# Altium schematic sheet PowerBoard.SchDoc
size A4; SheetNumber: 1; SheetTotal: 1
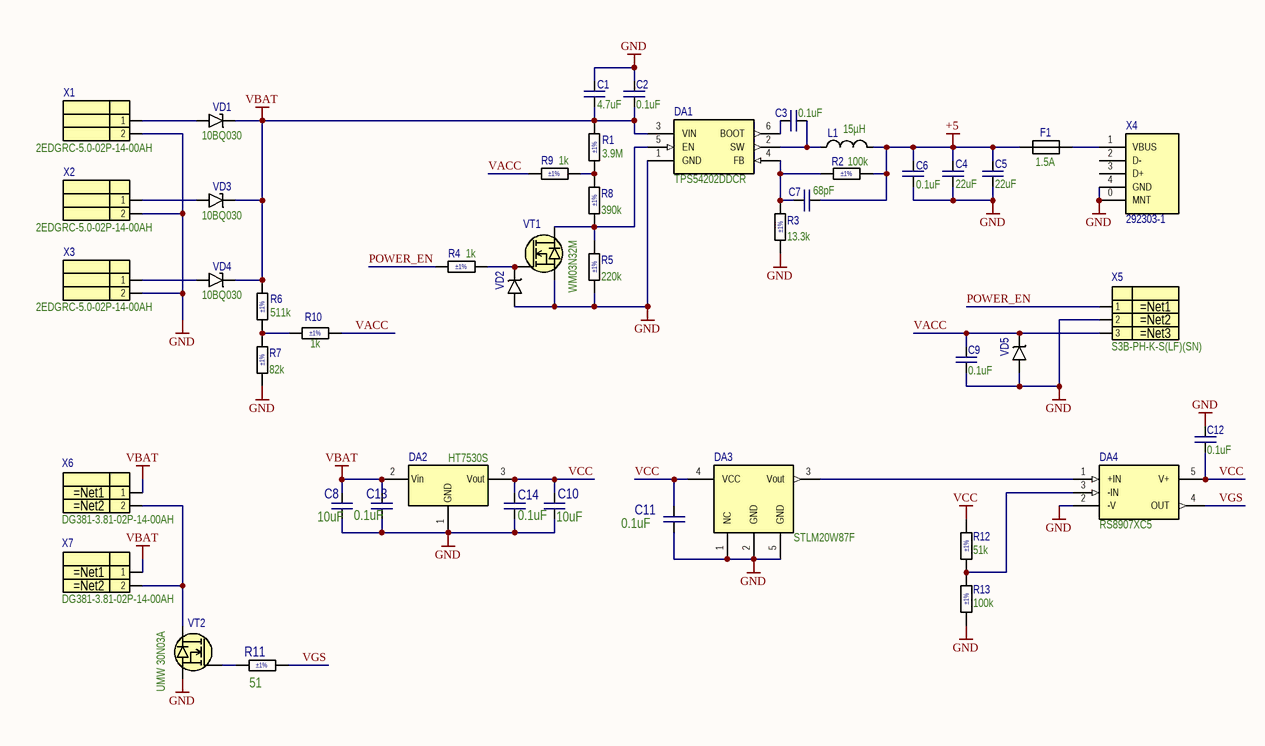
[diagram p0: PowerBoard.SchDoc]

## Parts
C1  4.7uF  [C0805 (2012 Metric) N]
C2  0.1uF  [C0603 (1608 Metric) N]
C3  0.1uF  [C0603 (1608 Metric) N]
C4  22uF  [C0805 (2012 Metric) N]
C5  22uF  [C0805 (2012 Metric) N]
C6  0.1uF  [C0603 (1608 Metric) N]
C7  68pF  [C0603 (1608 Metric) N]
C8  10uF  [C0603 (1608 Metric) N]
C9  0.1uF  [C0603 (1608 Metric) N]
C10  10uF  [C0603 (1608 Metric) N]
C11  0.1uF  [C0603 (1608 Metric) N]
C12  0.1uF  [C0603 (1608 Metric) N]
C13  0.1uF  [C0603 (1608 Metric) N]
C14  0.1uF  [C0603 (1608 Metric) N]
DA1  TPS54202DDCR  [SOT95P280X110-6N]
DA2  HT7530S  [SOT23-3]
DA3  STLM20W87F  [STLM20DD9F - duplicate]
DA4  RS8907XC5  [SOT23-5]
F1  1.5A  [F0603 (1608 Metric) N]
L1  15µH  [CDRH5D28]
R1  3.9M  Tolerance: ±1%  [R0603 (1608 Metric) N]
R2  100k  Tolerance: ±1%  [R0603 (1608 Metric) N]
R3  13.3k  Tolerance: ±1%  [R0603 (1608 Metric) N]
R4  1k  Tolerance: ±1%  [R0603 (1608 Metric) N]
R5  220k  Tolerance: ±1%  [R0603 (1608 Metric) N]
R6  511k  Tolerance: ±1%  [R0603 (1608 Metric) N]
R7  82k  Tolerance: ±1%  [R0603 (1608 Metric) N]
R8  390k  Tolerance: ±1%  [R0603 (1608 Metric) N]
R9  1k  Tolerance: ±1%  [R0603 (1608 Metric) N]
R10  1k  Tolerance: ±1%  [R0603 (1608 Metric) N]
R11  51  Tolerance: ±1%  [R0603 (1608 Metric) N]
R12  51k  Tolerance: ±1%  [R0603 (1608 Metric) N]
R13  100k  Tolerance: ±1%  [R0603 (1608 Metric) N]
VD1  10BQ030  [DO-214AA ( SMB )]
VD2  PESD12VS1UB  [SOD-523]  (value not drawn)
VD3  10BQ030  [DO-214AA ( SMB )]
VD4  10BQ030  [DO-214AA ( SMB )]
VD5  PESD12VS1UB  [SOD-523]  (value not drawn)
VT1  WM03N32M  [SOT95P245X110-3N]
VT2  UMW 30N03A  [TO-252]
X1  2EDGRC-5.0-02P-14-00AH  [2EDGRC-5.0-02P-14]
X2  2EDGRC-5.0-02P-14-00AH  [2EDGRC-5.0-02P-14]
X3  2EDGRC-5.0-02P-14-00AH  [2EDGRC-5.0-02P-14]
X4  292303-1  [TE-292303-1]
X5  S3B-PH-K-S(LF)(SN)  [S3B-PH-K-S(LF)(SN)]
X6  DG381-3.81-02P-14-00AH  [DG381-3.81-02P-14-00AH]
X7  DG381-3.81-02P-14-00AH  [DG381-3.81-02P-14-00AH]

## Nets
+5: C4.1 C5.1 C6.2 C7.2 F1.1 L1.2 R2.2
GND: C1.1 C2.2 C4.2 C5.2 C6.1 C8.2 C9.1 C10.2 C11.2 C12.2 C13.2 C14.2 DA1.1(GND) DA2.1(GND) DA3.1(NC) DA3.2(GND) DA3.5(GND) DA4.2(-V) R3.1 R5.1 R7.1 R13.1 VD2.A VD5.A VT1.S VT2.S X1.2 X2.2 X3.2 X4.0(MNT) X4.4(GND) X5.2
VBAT: C1.2 C2.1 C8.1 C13.1 DA1.3(VIN) DA2.2(Vin) R1.2 R6.2 VD1.C VD3.C VD4.C X6.1 X7.1
VCC: C10.1 C11.1 C12.1 C14.1 DA2.3(Vout) DA3.4(VCC) DA4.5(V+) R12.2
POWER_EN: R4.1 X5.1
VACC: C9.2 R9.1 R10.2 VD5.C X5.3
VGS: DA4.4(OUT) R11.2
NetC3_1: C3.1 DA1.6(BOOT)
NetC3_2: C3.2 DA1.2(SW) L1.1
NetC7_1: C7.1 DA1.4(FB) R2.1 R3.2
NetDA1_5: DA1.5(EN) R5.2 R8.1 VT1.D
NetDA3_3: DA3.3(Vout) DA4.1(+IN)
NetDA4_3: DA4.3(-IN) R12.1 R13.2
NetF1_2: F1.2 X4.1(VBUS)
NetR1_1: R1.1 R8.2 R9.2
NetR4_2: R4.2 VD2.C VT1.G
NetR6_1: R6.1 R7.2 R10.1
NetR11_1: R11.1 VT2.G
NetVD1_A: VD1.A X1.1
NetVD3_A: VD3.A X2.1
NetVD4_A: VD4.A X3.1
NetVT2_D: VT2.D X6.2 X7.2

Not connected (* = marked no-connect by the designer): X4 2(D-) 3(D+)

## Library data of the parts
C1 = CL21A475KBQNNNE: CAP CER 4.7UF 50V X5R 0805; Manufacturer: Samsung Electro-Mechanics; Points: 2; Factory Stock: 0; Unit Price (USD): 0.12360; Minimum Quantity: 2000; Tolerance: ±10%; Part Number: CL21A475KBQNNNE; ComponentLink1URL: http://www.samsungsem.com/kr/support/product-search/mlcc/CL21A475KBQNNNE.jsp; ComponentLink1Description: Datasheet; Supplier 1: Digikey; Supplier Part Number 1: 1276-1248-1-ND; Image: //media.digikey.com/Renders/Samsung%20Electro-Mechanics%20America/0805-(1.40)-CL-Series.jpg; Quantity Available: 20000; @ qty: 0; Packaging: Tape & Reel (TR); Series: CL; Part Status: Active; Value: 4.7uF; Voltage - Rated: 50V; Temperature Coefficient: X5R; Operating Temperature: -55°C ~ 85°C; Features: -; Ratings: -; Applications: General Purpose; Failure Rate: -; Mounting Type: Surface Mount, MLCC; Package / Case: 0805 (2012 Metric); Size / Dimension: 0.079" L x 0.049" W (2.00mm x 1.25mm); Height - Seated (Max): -; Thickness (Max): 0.055" (1.40mm); Lead Spacing: -; Lead Style: -; Part Type: Capacitor
C2 C3 C6 C9 C12 = CL10B104KB8NNNC: CAP CER 0.1UF 50V X7R 0603; Manufacturer: Samsung Electro-Mechanics; Points: 2; Factory Stock: 0; Unit Price (USD): 0.00627; Minimum Quantity: 4000; Tolerance: ±10%; Part Number: CL10B104KB8NNNC; ComponentLink1URL: http://www.samsungsem.com/kr/support/product-search/mlcc/CL10B104KB8NNNC.jsp; ComponentLink1Description: Datasheet; Supplier 1: Digikey; Supplier Part Number 1: 1276-1000-1-ND; Image: //media.digikey.com/Renders/Samsung%20Electro-Mechanics%20America/CL%20Series%200603(1608%20Metric)%2010.jpg; Quantity Available: 0; @ qty: 0; Packaging: Tape & Reel (TR); Series: CL; Part Status: Active; Value: 0.1uF; Voltage - Rated: 50V; Temperature Coefficient: X7R; Operating Temperature: -55°C ~ 125°C; Features: -; Ratings: -; Applications: General Purpose; Failure Rate: -; Mounting Type: Surface Mount, MLCC; Package / Case: 0603 (1608 Metric); Size / Dimension: 0.063" L x 0.032" W (1.60mm x 0.80mm); Height - Seated (Max): -; Thickness (Max): 0.035" (0.90mm); Lead Spacing: -; Lead Style: -; Part Type: Capacitor
C4 C5 = CC0805MKX5R6BB226: CAP CER 22UF 10V X5R 0805; Manufacturer: Yageo; Points: 2; Factory Stock: 0; Unit Price (USD): Active; Tolerance: ±20%; Part Number: CC0805MKX5R6BB226; ComponentLink1URL: http://www.yageo.com/documents/recent/UPY-GPHC_X5R_4V-to-50V_25.pdf; ComponentLink1Description: Datasheet; Supplier 1: Digikey; Supplier Part Number 1: 311-1900-1-ND; Image: //media.digikey.com/Renders/Yageo%20Renders/0805%288%5E5mm%20thickness%29.jpg; Quantity Available: 0; @ qty: 0; Minimum Quantity: 0; Packaging: Tape & Reel (TR); Series: CC; Part Status: Active; Value: 22uF; Voltage - Rated: 10V; Temperature Coefficient: X5R; Operating Temperature: -55°C ~ 85°C; Features: -; Ratings: -; Applications: General Purpose; Failure Rate: -; Mounting Type: Surface Mount, MLCC; Package / Case: 0805 (2012 Metric); Size / Dimension: 0.079" L x 0.049" W (2.00mm x 1.25mm); Height - Seated (Max): -; Thickness (Max): 0.057" (1.45mm); Lead Spacing: -; Lead Style: -; Part Type: Capacitor
C7 = CC0603JRNPO9BN680: CAP CER 68PF 50V C0G/NPO 0603; Manufacturer: Yageo; Points: 2; Factory Stock: 0; Unit Price (USD): 0.01379; Minimum Quantity: 4000; Tolerance: ±5%; Temperature Coefficient: C0G, NP0; Part Number: CC0603JRNPO9BN680; ComponentLink1URL: http://www.yageo.com/documents/recent/UPY-GP_NP0_16V-to-50V_16.pdf; ComponentLink1Description: Datasheet; Supplier 1: Digikey; Supplier Part Number 1: 311-1067-1-ND; Image: //media.digikey.com/Renders/Yageo%20Renders/0603%289mmthickness%29.jpg; Quantity Available: 40000; @ qty: 0; Packaging: Tape & Reel (TR); Series: CC; Part Status: Active; Value: 68pF; Voltage - Rated: 50V; Operating Temperature: -55°C ~ 125°C; Features: -; Ratings: -; Applications: General Purpose; Failure Rate: -; Mounting Type: Surface Mount, MLCC; Package / Case: 0603 (1608 Metric); Size / Dimension: 0.063" L x 0.032" W (1.60mm x 0.80mm); Height - Seated (Max): -; Thickness (Max): 0.035" (0.90mm); Lead Spacing: -; Lead Style: -; Part Type: Capacitor
C8 = CC0603JRNPO9BN680: CAP CER 10uF 35V C0G/NPO 0603; Part Number: GRM188R6YA106MA73D; Manufacturer: Yageo; Points: 2; Factory Stock: 0; Unit Price (USD): 0.01379; Minimum Quantity: 4000; Tolerance: ±5%; Voltage - Rated: 50V; Temperature Coefficient: C0G, NP0; ComponentLink1URL: http://www.yageo.com/documents/recent/UPY-GP_NP0_16V-to-50V_16.pdf; ComponentLink1Description: Datasheet; Supplier 1: Digikey; Supplier Part Number 1: 311-1067-1-ND; Image: //media.digikey.com/Renders/Yageo%20Renders/0603%289mmthickness%29.jpg; Quantity Available: 40000; @ qty: 0; Packaging: Tape & Reel (TR); Series: CC; Part Status: Active; Value: 10uF; Operating Temperature: -55°C ~ 125°C; Features: -; Ratings: -; Applications: General Purpose; Failure Rate: -; Mounting Type: Surface Mount, MLCC; Package / Case: 0603 (1608 Metric); Size / Dimension: 0.063" L x 0.032" W (1.60mm x 0.80mm); Height - Seated (Max): -; Thickness (Max): 0.035" (0.90mm); Lead Spacing: -; Lead Style: -; Part Type: Capacitor
C10 = CC0603JRNPO9BN680: CAP CER 10uF 6.3V C0G/NPO 0603; Part Number: CC0603MRX6S5BB106; Manufacturer: Yageo; Points: 2; Factory Stock: 0; Unit Price (USD): 0.01379; Minimum Quantity: 4000; Tolerance: ±5%; Voltage - Rated: 50V; Temperature Coefficient: C0G, NP0; ComponentLink1URL: http://www.yageo.com/documents/recent/UPY-GP_NP0_16V-to-50V_16.pdf; ComponentLink1Description: Datasheet; Supplier 1: Digikey; Supplier Part Number 1: 311-1067-1-ND; Image: //media.digikey.com/Renders/Yageo%20Renders/0603%289mmthickness%29.jpg; Quantity Available: 40000; @ qty: 0; Packaging: Tape & Reel (TR); Series: CC; Part Status: Active; Value: 10uF; Operating Temperature: -55°C ~ 125°C; Features: -; Ratings: -; Applications: General Purpose; Failure Rate: -; Mounting Type: Surface Mount, MLCC; Package / Case: 0603 (1608 Metric); Size / Dimension: 0.063" L x 0.032" W (1.60mm x 0.80mm); Height - Seated (Max): -; Thickness (Max): 0.035" (0.90mm); Lead Spacing: -; Lead Style: -; Part Type: Capacitor
C11 C13 C14 = CC0603JRNPO9BN680: CAP CER 0.1uF 50V C0G/NPO 0603; Part Number: CC0603JRX7R9BB104; Manufacturer: Yageo; Points: 2; Factory Stock: 0; Unit Price (USD): 0.01379; Minimum Quantity: 4000; Tolerance: ±5%; Temperature Coefficient: C0G, NP0; ComponentLink1URL: http://www.yageo.com/documents/recent/UPY-GP_NP0_16V-to-50V_16.pdf; ComponentLink1Description: Datasheet; Supplier 1: Digikey; Supplier Part Number 1: 311-1067-1-ND; Image: //media.digikey.com/Renders/Yageo%20Renders/0603%289mmthickness%29.jpg; Quantity Available: 40000; @ qty: 0; Packaging: Tape & Reel (TR); Series: CC; Part Status: Active; Value: 0.1uF; Voltage - Rated: 50V; Operating Temperature: -55°C ~ 125°C; Features: -; Ratings: -; Applications: General Purpose; Failure Rate: -; Mounting Type: Surface Mount, MLCC; Package / Case: 0603 (1608 Metric); Size / Dimension: 0.063" L x 0.032" W (1.60mm x 0.80mm); Height - Seated (Max): -; Thickness (Max): 0.035" (0.90mm); Lead Spacing: -; Lead Style: -; Part Type: Capacitor
DA1 = TPS54202: Power Supply; Manufacturer_Name: Texas Instruments; Datasheet Link: http://www.ti.com/lit/gpn/tps54202; Height: 1.1mm; Part Number: TPS54202DDCR; Mouser Part Number: 595-TPS54202DDCR; Mouser Price/Stock: https://www.mouser.co.uk/ProductDetail/Texas-Instruments/TPS54202DDCR?qs=uP22XH7NdCsJtN%2Fq54jCtQ%3D%3D; Arrow Part Number: TPS54202DDCR; Arrow Price/Stock: https://www.arrow.com/en/products/tps54202ddcr/texas-instruments?region=nac; ComponentLink1Description: Datasheet; ComponentLink1URL: https://static.chipdip.ru/lib/513/DOC010513657.pdf
DA2 = UMW HT7530S: Power Supply; Part Number: HT7530S
DA3 = STLM20DD9F: Ultra-low current 2.4 V precision analog temperature sensor; ComponentLink1Description: https://www.compel.ru/item-pdf/a7e49e4dedba0033f1ae17c65d4c1409/pn/st~stlm20dd9f.pdf; ComponentLink1URL: https://www.compel.ru/item-pdf/a7e49e4dedba0033f1ae17c65d4c1409/pn/st~stlm20dd9f.pdf; Part Number: STLM20W87F
DA4 = RS8907XC5: Nano-Power, CMOS Input, RRIO, / Push-Pull Output Comparator; ComponentLink1Description: https://data.electronshik.ru/z/Datasheet/R/RS8907.pdf; ComponentLink1URL: https://data.electronshik.ru/z/Datasheet/R/RS8907.pdf; Part Number: RS8907XC5
F1 = 0603L075SLYR: PTC RESET FUSE 6V 750MA 0603; Manufacturer: Littelfuse Inc.; Factory Stock: 0; Unit Price (USD): 1.91000; Minimum Quantity: 1; Type: Polymeric; Current - Max: 50A; Time to Trip: 200ms; Resistance - Initial (Ri) (Min): 20 mOhms; Resistance - Post Trip (R1) (Max): 165 mOhms; Part Number: 0603L075SLYR; ComponentLink1URL: http://www.littelfuse.com/~/media/electronics/datasheets/resettable_ptcs/littelfuse_ptc_lorho_datasheet.pdf.pdf; ComponentLink1Description: Datasheet; Supplier 1: Digikey; Supplier Part Number 1: F5777CT-ND; Image: //media.digikey.com/Renders/Littelfuse%20Renders/Poly-Fuse%200603%20(1608%20Metric)%20Concave.jpg; Quantity Available: 15808; @ qty: 0; Packaging: Cut Tape (CT); Series: POLY-FUSE®, LoRho; Part Status: Active; Voltage - Max: 6V; Current - Hold (Ih) (Max): 750mA; Current - Trip (It): 1.5A; Resistance - 25°C (Typ): -; Operating Temperature: -40°C ~ 85°C; Ratings: -; Mounting Type: Surface Mount; Package / Case: 0603 (1608 Metric), Concave; Size / Dimension: 0.063" L x 0.032" W (1.60mm x 0.80mm); Height - Seated (Max): -; Thickness (Max): 0.030" (0.75mm); Lead Spacing: -
L1 = CDRH5D28NP-150NC: FIXED IND 15UH 1.1A 103 MOHM SMD; Manufacturer: Sumida America Components Inc.; Points: 2; Unit Price (USD): 0.28900; Material - Core: Ferrite; Tolerance: ±30%; Shielding: Shielded; DC Resistance (DCR): 103 mOhm Max; Frequency - Test: 100kHz; Value: 15µH; Part Number: CDRH5D28NP-150NC; ComponentLink1URL: http://products.sumida.com/products/pdf/CDRH5D28.pdf; ComponentLink1Description: Datasheet; Supplier Part Number 1: 308-2195-2-ND; Part Status: Active; Type: -; Current Rating: 1.1A; Current - Saturation: -; Q @ Freq: -; Frequency - Self Resonant: -; Ratings: -; Operating Temperature: -40°C ~ 100°C; Mounting Type: Surface Mount; Package / Case: Nonstandard; Supplier Device Package: -; Size / Dimension: 0.224" L x 0.224" W (5.70mm x 5.70mm); Height - Seated (Max): 0.118" (3.00mm); Image: //media.digikey.com/photos/Sumida%20Photos/CDRH5D%20SERIES.jpg
R1 = RC0603FR-07511KL: RES SMD 511K OHM 1% 1/10W 0603; Part Number: RC0603FR-073M9L; Manufacturer: Yageo; Points: 2; ValueGOST: 511кОм; Unit Price (USD): 0.10000; Power (Watts): 0.1W, 1/10W; Temperature Coefficient: ±100ppm/°C; ComponentLink1URL: http://www.yageo.com/documents/recent/PYu-RC_Grou; ComponentLink1Description: Datasheet; Supplier 1: Digikey; Supplier Part Number 1: 311-511KHRCT-ND; Value: 3.9M; Package / Case: 0603 (1608 Metric); Series: RC; Part Status: Active; Composition: Thick Film; Features: Moisture Resistant; Operating Temperature: -55°C ~ 155°C; Supplier Device Package: 0603; Size / Dimension: 0.063" L x 0.031" W (1.60mm x 0.80mm); Height - Seated (Max): 0.022" (0.55mm); Image: //media.digikey.com/Renders/Yageo%20Renders/0603-(1608-Metric).jpg; Part Type: Resistor
R2 R13 = RC0603FR-07100KL: RES SMD 100K OHM 1% 1/10W 0603; Manufacturer: Yageo; Points: 2; ValueGOST: 100кОм; Unit Price (USD): 0.10000; Power (Watts): 0.1W, 1/10W; Temperature Coefficient: ±100ppm/°C; Part Number: RC0603FR-07100KL; ComponentLink1URL: http://www.yageo.com/documents/recent/PYu-RC_Grou; ComponentLink1Description: Datasheet; Supplier 1: Digikey; Supplier Part Number 1: 311-100KHRCT-ND; Value: 100k; Package / Case: 0603 (1608 Metric); Series: RC; Part Status: Active; Composition: Thick Film; Features: Moisture Resistant; Operating Temperature: -55°C ~ 155°C; Supplier Device Package: 0603; Size / Dimension: 0.063" L x 0.031" W (1.60mm x 0.80mm); Height - Seated (Max): 0.022" (0.55mm); Image: //media.digikey.com/Renders/Yageo%20Renders/0603-(1608-Metric).jpg; Part Type: Resistor
R3 = RC0603FR-0713K3L: RES SMD 13.3K OHM 1% 1/10W 0603; Manufacturer: Yageo; Points: 2; ValueGOST: 13.3кОм; Unit Price (USD): 0.10000; Power (Watts): 0.1W, 1/10W; Temperature Coefficient: ±100ppm/°C; Part Number: RC0603FR-0713K3L; ComponentLink1URL: http://www.yageo.com/documents/recent/PYu-RC_Grou; ComponentLink1Description: Datasheet; Supplier 1: Digikey; Supplier Part Number 1: 311-13.3KHRCT-ND; Value: 13.3k; Package / Case: 0603 (1608 Metric); Series: RC; Part Status: Active; Composition: Thick Film; Features: Moisture Resistant; Operating Temperature: -55°C ~ 155°C; Supplier Device Package: 0603; Size / Dimension: 0.063" L x 0.031" W (1.60mm x 0.80mm); Height - Seated (Max): 0.022" (0.55mm); Image: //media.digikey.com/Renders/Yageo%20Renders/0603-(1608-Metric).jpg; Part Type: Resistor
R4 R9 R10 = RC0603FR-071KL: RES SMD 1K OHM 1% 1/10W 0603; Manufacturer: Yageo; Points: 2; ValueGOST: 1кОм; Unit Price (USD): 0.10000; Power (Watts): 0.1W, 1/10W; Temperature Coefficient: ±100ppm/°C; Part Number: RC0603FR-071KL; ComponentLink1URL: http://www.yageo.com/documents/recent/PYu-RC_Grou; ComponentLink1Description: Datasheet; Supplier 1: Digikey; Supplier Part Number 1: 311-1.00KHRCT-ND; Value: 1k; Package / Case: 0603 (1608 Metric); Series: RC; Part Status: Active; Composition: Thick Film; Features: Moisture Resistant; Operating Temperature: -55°C ~ 155°C; Supplier Device Package: 0603; Size / Dimension: 0.063" L x 0.031" W (1.60mm x 0.80mm); Height - Seated (Max): 0.022" (0.55mm); Image: //media.digikey.com/Renders/Yageo%20Renders/0603-(1608-Metric).jpg; Part Type: Resistor
R5 = RC0603FR-07100KL: RES SMD 100K OHM 1% 1/10W 0603; Part Number: RC0603FR-07220KL; Manufacturer: Yageo; Points: 2; ValueGOST: 100кОм; Unit Price (USD): 0.10000; Power (Watts): 0.1W, 1/10W; Temperature Coefficient: ±100ppm/°C; ComponentLink1URL: http://www.yageo.com/documents/recent/PYu-RC_Grou; ComponentLink1Description: Datasheet; Supplier 1: Digikey; Supplier Part Number 1: 311-100KHRCT-ND; Value: 220k; Package / Case: 0603 (1608 Metric); Series: RC; Part Status: Active; Composition: Thick Film; Features: Moisture Resistant; Operating Temperature: -55°C ~ 155°C; Supplier Device Package: 0603; Size / Dimension: 0.063" L x 0.031" W (1.60mm x 0.80mm); Height - Seated (Max): 0.022" (0.55mm); Image: //media.digikey.com/Renders/Yageo%20Renders/0603-(1608-Metric).jpg; Part Type: Resistor
R6 = RC0603FR-07511KL: RES SMD 511K OHM 1% 1/10W 0603; Manufacturer: Yageo; Points: 2; ValueGOST: 511кОм; Unit Price (USD): 0.10000; Power (Watts): 0.1W, 1/10W; Temperature Coefficient: ±100ppm/°C; Part Number: RC0603FR-07511KL; ComponentLink1URL: http://www.yageo.com/documents/recent/PYu-RC_Grou; ComponentLink1Description: Datasheet; Supplier 1: Digikey; Supplier Part Number 1: 311-511KHRCT-ND; Value: 511k; Package / Case: 0603 (1608 Metric); Series: RC; Part Status: Active; Composition: Thick Film; Features: Moisture Resistant; Operating Temperature: -55°C ~ 155°C; Supplier Device Package: 0603; Size / Dimension: 0.063" L x 0.031" W (1.60mm x 0.80mm); Height - Seated (Max): 0.022" (0.55mm); Image: //media.digikey.com/Renders/Yageo%20Renders/0603-(1608-Metric).jpg; Part Type: Resistor
R7 = RC0603FR-07100KL: RES SMD 100K OHM 1% 1/10W 0603; Part Number: RC0603FR-0782KL; Manufacturer: Yageo; Points: 2; ValueGOST: 100кОм; Unit Price (USD): 0.10000; Power (Watts): 0.1W, 1/10W; Temperature Coefficient: ±100ppm/°C; ComponentLink1URL: http://www.yageo.com/documents/recent/PYu-RC_Grou; ComponentLink1Description: Datasheet; Supplier 1: Digikey; Supplier Part Number 1: 311-100KHRCT-ND; Value: 82k; Package / Case: 0603 (1608 Metric); Series: RC; Part Status: Active; Composition: Thick Film; Features: Moisture Resistant; Operating Temperature: -55°C ~ 155°C; Supplier Device Package: 0603; Size / Dimension: 0.063" L x 0.031" W (1.60mm x 0.80mm); Height - Seated (Max): 0.022" (0.55mm); Image: //media.digikey.com/Renders/Yageo%20Renders/0603-(1608-Metric).jpg; Part Type: Resistor
R8 = RC0603FR-07100KL: RES SMD 100K OHM 1% 1/10W 0603; Part Number: RC0603FR-07390KL; Manufacturer: Yageo; Points: 2; ValueGOST: 100кОм; Unit Price (USD): 0.10000; Power (Watts): 0.1W, 1/10W; Temperature Coefficient: ±100ppm/°C; ComponentLink1URL: http://www.yageo.com/documents/recent/PYu-RC_Grou; ComponentLink1Description: Datasheet; Supplier 1: Digikey; Supplier Part Number 1: 311-100KHRCT-ND; Value: 390k; Package / Case: 0603 (1608 Metric); Series: RC; Part Status: Active; Composition: Thick Film; Features: Moisture Resistant; Operating Temperature: -55°C ~ 155°C; Supplier Device Package: 0603; Size / Dimension: 0.063" L x 0.031" W (1.60mm x 0.80mm); Height - Seated (Max): 0.022" (0.55mm); Image: //media.digikey.com/Renders/Yageo%20Renders/0603-(1608-Metric).jpg; Part Type: Resistor
R11 = RC0603FR-0751RL: RES SMD 51 OHM 1% 1/10W 0603; Manufacturer: Yageo; Points: 2; Unit Price (USD): 0.10000; Power (Watts): 0.1W, 1/10W; Temperature Coefficient: ±100ppm/°C; Part Number: RC0603FR-0751RL; ComponentLink1URL: http://www.yageo.com/documents/recent/PYu-RC_Grou; ComponentLink1Description: Datasheet; Supplier 1: Digikey; Supplier Part Number 1: 311-51.0HRCT-ND; Value: 51; ValueGOST: 51; Package / Case: 0603 (1608 Metric); Series: RC; Part Status: Active; Composition: Thick Film; Features: Moisture Resistant; Operating Temperature: -55°C ~ 155°C; Supplier Device Package: 0603; Size / Dimension: 0.063" L x 0.031" W (1.60mm x 0.80mm); Height - Seated (Max): 0.022" (0.55mm); Image: //media.digikey.com/Renders/Yageo%20Renders/0603-(1608-Metric).jpg; Part Type: Resistor
R12 = RC0603FR-071KL: RES SMD 1K OHM 1% 1/10W 0603; Part Number: RC0603FR-0751KL; Manufacturer: Yageo; Points: 2; ValueGOST: 1кОм; Unit Price (USD): 0.10000; Power (Watts): 0.1W, 1/10W; Temperature Coefficient: ±100ppm/°C; ComponentLink1URL: http://www.yageo.com/documents/recent/PYu-RC_Grou; ComponentLink1Description: Datasheet; Supplier 1: Digikey; Supplier Part Number 1: 311-1.00KHRCT-ND; Value: 51k; Package / Case: 0603 (1608 Metric); Series: RC; Part Status: Active; Composition: Thick Film; Features: Moisture Resistant; Operating Temperature: -55°C ~ 155°C; Supplier Device Package: 0603; Size / Dimension: 0.063" L x 0.031" W (1.60mm x 0.80mm); Height - Seated (Max): 0.022" (0.55mm); Image: //media.digikey.com/Renders/Yageo%20Renders/0603-(1608-Metric).jpg; Part Type: Resistor
VD1 VD3 VD4 = 10BQ030: DIODE SCHOTTKY 30V 1A SMB; Manufacturer: Vishay Semiconductor Diodes Division; Unit Price (USD): Obsolete; Voltage - Forward (Vf) (Max) @ If: 420mV @ 1A; Speed: Fast Recovery =< 500ns, > 200mA (Io); Current - Reverse Leakage @ Vr: 500µA @ 30V; Part Number: 10BQ030; ComponentLink1URL: //media.digikey.com/pdf/Data%20Sheets/Vishay%20Semiconductors/VS-10BQ030PbF.pdf; ComponentLink1Description: Datasheet; Supplier 1: Digikey; Supplier Part Number 1: 10BQ030-ND; Series: -; Diode Type: Schottky; Voltage - DC Reverse (Vr) (Max): 30V; Current - Average Rectified (Io): 1A; Reverse Recovery Time (trr): -; Capacitance @ Vr, F: -; Mounting Type: Surface Mount; Package / Case: DO-214AA, SMB; Supplier Device Package: SMB; Operating Temperature - Junction: -55°C ~ 150°C
VD2 VD5 = PESD12VS1UB: ESD protection diodes; Manufacturer: Nexperia; Points: 0; Unidirectional Channels: 1; Voltage - Reverse Standoff (Typ): 3.3; Voltage - Breakdown (Min): 5.2; Voltage - Clamping (Max) @ Ipp: 6.0; Current - Peak Pulse (10/1000µs): 18A; Power - Peak Pulse: 330; Power Line Protection: Yes; Part Number: PESD12VS1UB; ComponentLink1URL: https://static.chipdip.ru/lib/010/DOC013010914.pdf; ComponentLink1Description: Datasheet; Supplier 1: ChipDip; Supplier Part Number 1: PESD12VS1UB; Series: PESDxS1UB; Part Status: Active; Bidirectional Channels: 0; Applications: General Purpose; ComponentLink10Description: Local Supplier
VT1 = WM03N32M: N-Channel MOSFET; Manufacturer: way-on; Drain to Source Voltage (Vdss): 30V; Current - Continuous Drain (Id) @ 25°C: 3.2A; Drive Voltage (Max Rds On,  Min Rds On): 4.5V; Vgs(th) (Max) @ Id: 1.5; Part Number: WM03N32M; ComponentLink1URL: https://datasheet.lcsc.com/lcsc/2206101730_Wayon-WM03N32M_C3030969.pdf; ComponentLink1Description: Datasheet; ComponentLink2URL: https://www.electronshik.ru/item/WAYON/WM03N32M; ComponentLink2Description: Local Supplier; Supplier 1: electronshik.ru; FET Type: N-Channel
VT2 = UMW 30N03A: 30V N-Channel Power; Part Number: UMW 30N03A; ComponentLink1Description: https://static.chipdip.ru/lib/039/DOC013039432.pdf; ComponentLink1URL: https://static.chipdip.ru/lib/039/DOC013039432.pdf
X1-X3 = 2EDGRC-5.0-02P-14-00AH: TERM BLOCK HDR 2POS 90DEG 5MM; Manufacturer: Degson; Number of Positions: 2; Number of Levels: 1; Pitch: 0.197" (5.00mm); Header Orientation: 90°, Right Angle90°, Right Angle; Current - IEC: 15A; Voltage - IEC: 300V; Current - UL: 10A; Part Number: 2EDGRC-5.0-02P-14-00AH; ComponentLink1URL: https://ru.degson.com/content/details_552_1153432.html?lang=ru; ComponentLink1Description: Product Page; Series: 2EDGRC; Part Status: Active; Positions Per Level: 2; Termination Style: Solder; Mounting Type: Through Hole; Voltage - UL: 300V; Color: Green; Operating Temperature: -40°C ~ 105°C
X4 = 292303-1: USB A R/A RCPT ASSY SMT; Part Number: 292303-1
X5 = S3B-PH-K-S(LF)(SN): CONN HEADER SMD R/A 3POS 2MM; Part Number: S3B-PH-K-S(LF)(SN); ComponentLink1Description: https://www.jst-mfg.com/product/pdf/eng/ePH.pdf; ComponentLink1URL: https://www.jst-mfg.com/product/pdf/eng/ePH.pdf
X6 X7 = DG381-3.81-02P-14-00AH: Part Number: DG381-3.81-02P-14-00AH